# Altium project AD8318.PrjPcb
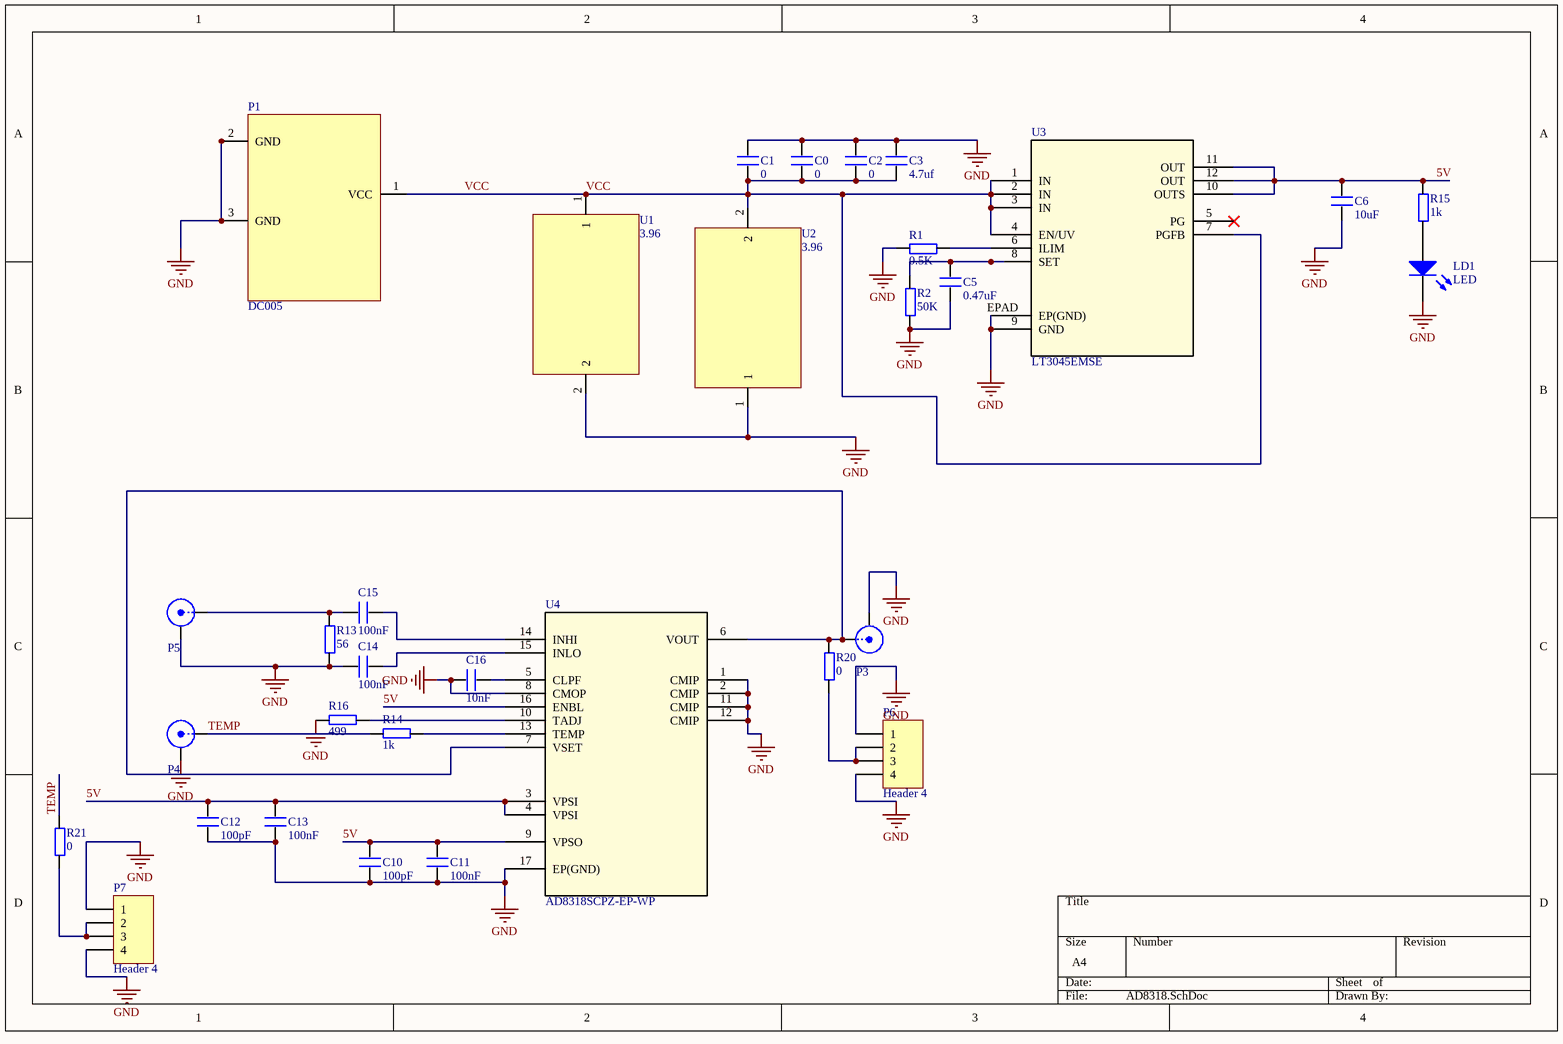
[diagram p0: AD8318.SchDoc]
1 sheet, 32 parts. Net scope: global (net labels, ports and power ports of the same name join across sheets).
Board file: AD8318.PcbDoc

## Sheet AD8318.SchDoc
size A4

### Parts
C0  0  [CAP 1.5*4*8]
C1  0  [CAP 1.5*4*8]
C2  0  [0603C]
C3  4.7uf  [0603C]
C5  0.47uF  [0402]
C6  10uF  [0402]
C10  100pF  [0402]
C11  100nF  [0402]
C12  100pF  [0402]
C13  100nF  [0402]
C14  100nF  [0402]
C15  100nF  [0402]
C16  10nF  [0402]
LD1  LED  [SMDLED]
P1  DC005  [DC10B]
P3  SMA  [SMA]  (value not drawn)
P4  SMA  [SMA]  (value not drawn)
P5  SMA  [SMA]  (value not drawn)
P6  Header 4  [HDR1X4]
P7  Header 4  [HDR1X4]
R1  0.5K  [0402]
R2  50K  [0402]
R13  56  [0402]
R14  1k  [0402]
R15  1k  [0603R]
R16  499  [0402]
R20  0  [0402]
R21  0  [0402]
U1  3.96  [3.96]
U2  3.96  [3.96]
U3  LT3045EMSE  [MSOP12-MSE-RevG_ADI]
U4  AD8318SCPZ-EP-WP  [CP_16_23_ADI]

### Nets
GND: C0.2 C1.2 C2.2 C3.2 C5.2 C6.1 C10.1 C11.1 C12.1 C13.1 C14.2 C16.2 LD1.2(K) P1.2(GND) P1.3(GND) P3.2(Y) P4.2(Y) P5.2(Y) P6.1 P6.4 P7.1 P7.4 R1.1 R2.1 R13.1 R16.2 U1.2 U2.1 U3.9(GND) U3.EPAD(EP(GND)) U4.1(CMIP) U4.2(CMIP) U4.8(CMOP) U4.11(CMIP) U4.12(CMIP) U4.17(EP(GND))
5V: C6.2 C10.2 C11.2 C12.2 C13.2 R15.2 U3.10(OUTS) U3.11(OUT) U3.12(OUT) U4.3(VPSI) U4.4(VPSI) U4.9(VPSO) U4.16(ENBL)
TEMP: P4.1(X) R14.2 R21.2
VCC: C0.1 C1.1 C2.1 C3.1 P1.1(VCC) U1.1 U2.2 U3.1(IN) U3.2(IN) U3.3(IN) U3.4(EN/UV) U3.7(PGFB)
NetC5_1: C5.1 R2.2 U3.8(SET)
NetC14_1: C14.1 U4.15(INLO)
NetC15_1: C15.1 P5.1(X) R13.2
NetC15_2: C15.2 U4.14(INHI)
NetC16_1: C16.1 U4.5(CLPF)
NetLD1_1: LD1.1(A) R15.1
NetP3_1: P3.1(X) R20.2 U4.6(VOUT) U4.7(VSET)
NetP6_2: P6.2 P6.3 R20.1
NetP7_2: P7.2 P7.3 R21.1
NetR1_2: R1.2 U3.6(ILIM)
NetR14_1: R14.1 U4.13(TEMP)
NetR16_1: R16.1 U4.10(TADJ)

Not connected (* = marked no-connect by the designer): U3 5(PG)*

### Library data of the parts
C0-C3 C5 C6 C10-C16 = C: Capacitor
LD1 = LED: Typical RED, GREEN, YELLOW, AMBER GaAs LED; Published: 8-Jun-2000; LatestRevisionDate: 17-Jul-2002; LatestRevisionNote: Re-released for DXP Platform.; PackageDocument: Feb-2002; PackageReference: 3.2X1.6X1.1; Publisher: Altium Limited
P3-P5 = SMA: SMA Connector
P6 P7 = Header 4: Header, 4-Pin; LatestRevisionDate: 17-Jul-2002; LatestRevisionNote: Re-released for DXP Platform.; Publisher: Altium Limited
R1 R2 R13-R16 R20 R21 = Resistor
U3 = LT3045EMSE: No Description Available; SourceLibrary: Analog_Devices_Inc_2020-09-15; Built_By: SunStream; Vendor: Analog Devices Inc; Copyright: Copyright (C) 2018 Accelerated Designs. All rights reserved; Manufacturer_Part_Number: LT3045EMSE; RefDes: RefDes; Type: DEV
U4 = AD8318SCPZ-EP-WP: No Description Available; Vendor: Analog Devices Inc; SourceLibrary: Analog_2018-01-18; Built_By: Analog Devices Imc.; Manufacturer_Part_Number: AD8318SCPZ-EP-WP; Copyright: Copyright (C) 2018 Accelerated Designs. All rights reserved; RefDes: RefDes; Type: DEV